# Altium schematic sheet Button_Block.SchDoc
size A4; SheetNumber: 10; SheetTotal: 18
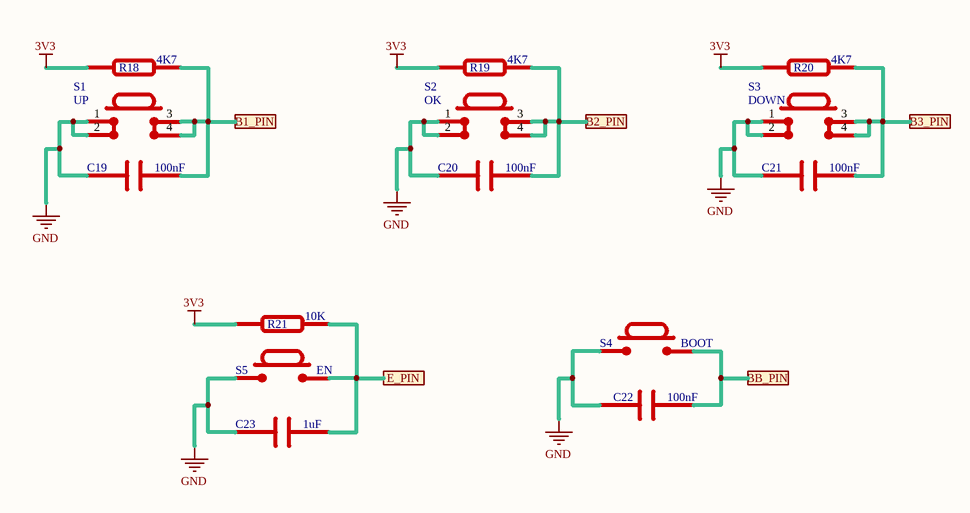
[diagram p0: Button_Block.SchDoc]

## Parts
C19  100nF  [C0805]
C20  100nF  [C0805]
C21  100nF  [C0805]
C22  100nF  [C0805]
C23  1uF  [C0805]
R18  4K7  [R0603]
R19  4K7  [R0603]
R20  4K7  [R0603]
R21  10K  [R0603]
S1  UP  [BTN-TH-6x6]
S2  OK  [BTN-TH-6x6]
S3  DOWN  [BTN-TH-6x6]
S4  BOOT  [BTN-SMD-3x6]
S5  EN  [BTN-SMD-3x6]

## Ports
B1_PIN, B2_PIN, B3_PIN, BB_PIN, E_PIN

## Nets
3V3: R18.2 R19.2 R20.2 R21.2
GND: C19.2 C20.2 C21.2 C22.2 C23.2 S1.1 S1.2 S2.1 S2.2 S3.1 S3.2 S4.1 S5.1
B1_PIN: C19.1 R18.1 S1.3 S1.4 ; port B1_PIN
B2_PIN: C20.1 R19.1 S2.3 S2.4 ; port B2_PIN
B3_PIN: C21.1 R20.1 S3.3 S3.4 ; port B3_PIN
BB_PIN: C22.1 S4.2 ; port BB_PIN
E_PIN: C23.1 R21.1 S5.2 ; port E_PIN

## Library data of the parts
C19-C23 = CAP-CER: Ceramic Capacitor
R18-R21 = Resistor
S1-S3 = Button-4P: Tactile Switch 4 pole
S4 S5 = Button-2P: Tactile Switch 2 pole